# Altium schematic sheet Temperature Measurement.SchDoc
size D
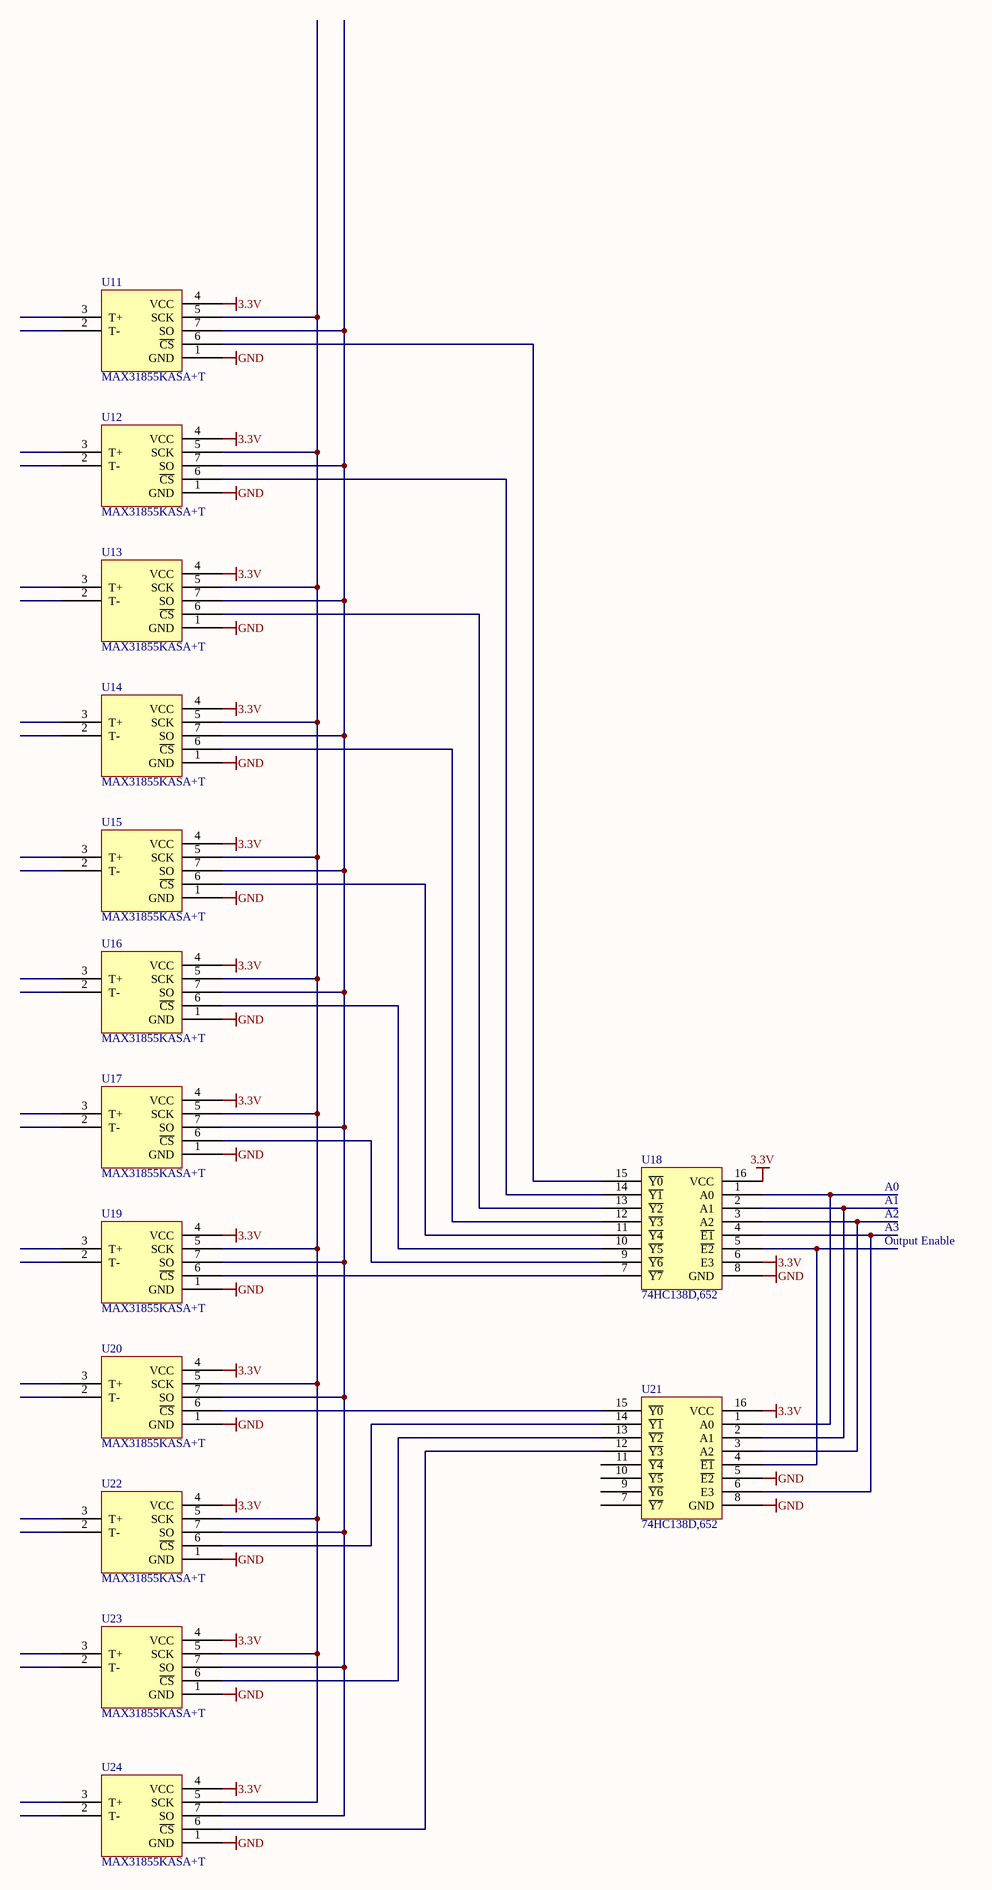
[diagram p0: Temperature Measurement.SchDoc]

## Parts
U11  MAX31855KASA+T  [SOIC 8]
U12  MAX31855KASA+T  [SOIC 8]
U13  MAX31855KASA+T  [SOIC 8]
U14  MAX31855KASA+T  [SOIC 8]
U15  MAX31855KASA+T  [SOIC 8]
U16  MAX31855KASA+T  [SOIC 8]
U17  MAX31855KASA+T  [SOIC 8]
U18  74HC138D,652  [SOIC 16 Wide]
U19  MAX31855KASA+T  [SOIC 8]
U20  MAX31855KASA+T  [SOIC 8]
U21  74HC138D,652  [SOIC 16 Wide]
U22  MAX31855KASA+T  [SOIC 8]
U23  MAX31855KASA+T  [SOIC 8]
U24  MAX31855KASA+T  [SOIC 8]

## Nets
3.3V: U11.4(VCC) U12.4(VCC) U13.4(VCC) U14.4(VCC) U15.4(VCC) U16.4(VCC) U17.4(VCC) U18.6(E3) U18.16(VCC) U19.4(VCC) U20.4(VCC) U21.16(VCC) U22.4(VCC) U23.4(VCC) U24.4(VCC)
GND: U11.1(GND) U12.1(GND) U13.1(GND) U14.1(GND) U15.1(GND) U16.1(GND) U17.1(GND) U18.8(GND) U19.1(GND) U20.1(GND) U21.5(~{E2}) U21.8(GND) U22.1(GND) U23.1(GND) U24.1(GND)
NetU11_5: U11.5(SCK) U12.5(SCK) U13.5(SCK) U14.5(SCK) U15.5(SCK) U16.5(SCK) U17.5(SCK) U19.5(SCK) U20.5(SCK) U22.5(SCK) U23.5(SCK) U24.5(SCK)
NetU11_6: U11.6(~{CS}) U18.15(~{Y0})
NetU11_7: U11.7(SO) U12.7(SO) U13.7(SO) U14.7(SO) U15.7(SO) U16.7(SO) U17.7(SO) U19.7(SO) U20.7(SO) U22.7(SO) U23.7(SO) U24.7(SO)
NetU12_6: U12.6(~{CS}) U18.14(~{Y1})
NetU13_6: U13.6(~{CS}) U18.13(~{Y2})
NetU14_6: U14.6(~{CS}) U18.12(~{Y3})
NetU15_6: U15.6(~{CS}) U18.11(~{Y4})
NetU16_6: U16.6(~{CS}) U18.10(~{Y5})
NetU17_6: U17.6(~{CS}) U18.9(~{Y6})
NetU18_1: U18.1(A0) U21.1(A0)
NetU18_2: U18.2(A1) U21.2(A1)
NetU18_3: U18.3(A2) U21.3(A2)
NetU18_4: U18.4(~{E1}) U21.6(E3)
NetU18_5: U18.5(~{E2}) U21.4(~{E1})
NetU18_7: U18.7(~{Y7}) U19.6(~{CS})
NetU20_6: U20.6(~{CS}) U21.15(~{Y0})
NetU21_12: U21.12(~{Y3}) U24.6(~{CS})
NetU21_13: U21.13(~{Y2}) U23.6(~{CS})
NetU21_14: U21.14(~{Y1}) U22.6(~{CS})

Not connected (* = marked no-connect by the designer): U11 2(T-) 3(T+); U12 2(T-) 3(T+); U13 2(T-) 3(T+); U14 2(T-) 3(T+); U15 2(T-) 3(T+); U16 2(T-) 3(T+); U17 2(T-) 3(T+); U19 2(T-) 3(T+); U20 2(T-) 3(T+); U21 7(~{Y7}) 9(~{Y6}) 10(~{Y5}) 11(~{Y4}); U22 2(T-) 3(T+); U23 2(T-) 3(T+); U24 2(T-) 3(T+)

## Notes on the sheet
- A0
- A1
- A2
- Output Enable
- A3
- -1
- 2
- Wavenumber
- Technologies
- pl
- Rev:
- Sheet
- of

## Library data of the parts
U11-U17 U19 U20 U22-U24 = MAX31855KASA+T: IC CONV THERMOCOUPLE-DGTL 8SOIC; Manufacturer: Maxim Integrated; Function: Thermocouple Cold Junction Compensator; Sensor Type: External; Sensing Temperature: -200°C ~ 1350°C; Accuracy: ±6°C(Max); Topology: ADC; Output Type: 3-Wire/SPI™ Serial; Output Alarm: No; Voltage - Supply: 3 V ~ 3.6 V; Supplier 1: Digi-Key; RoHS: RoHS Compliant; Category: Integrated Circuits (ICs); Stock 1: 2436; Pricing 1: 1=7.38, 25=5.5692, 100=4.8731, 500=4.45536 (USD); Packaging: Cut Tape (CT); Output Fan: No; Operating Temperature: -40°C ~ 125°C; Mounting Type: Surface Mount; Package / Case: 8-SOIC (0.154", 3.90mm Width); Supplier Device Package: 8-SOIC N; ComponentLink1URL: http://datasheets.maximintegrated.com/en/ds/MAX31855.pdf; ComponentLink1Description: http://datasheets.maximintegrated.com/en/ds/MAX31855.pdf; Supplier Part Number 1: MAX31855KASA+TCT-ND; Manufacturer Part Number: MAX31855KASA+T
U18 U21 = 74HC138D,652: IC DECODER/DEMUX 3-8 LINE 16SOIC; Manufacturer: NXP Semiconductors; Circuit: 1 x 3:8; Independent Circuits: 1; Current - Output High, Low: 5.2mA, 5.2mA; Voltage Supply Source: Single Supply; Voltage - Supply: 2 V ~ 6 V; Supplier 1: Digi-Key; RoHS: RoHS Compliant; Category: Integrated Circuits (ICs); Stock 1: 7188; Pricing 1: 1=0.55, 10=0.389, 25=0.3192, 100=0.2552, 250=0.1856, 500=0.1508, 1000=0.116, 2500=0.1044, 5000=0.0986 (USD); Packaging: Tube; Type: Decoder/Demultiplexer; Operating Temperature: -40°C ~ 125°C; Mounting Type: Surface Mount; Package / Case: 16-SOIC (0.154", 3.90mm Width); Supplier Device Package: 16-SO; ComponentLink1URL: http://www.nxp.com/documents/data_sheet/74HC_HCT138.pdf; ComponentLink1Description: http://www.nxp.com/documents/data_sheet/74HC_HCT138.pdf; Supplier Part Number 1: 568-3952-5-ND; Manufacturer Part Number: 74HC138D,652